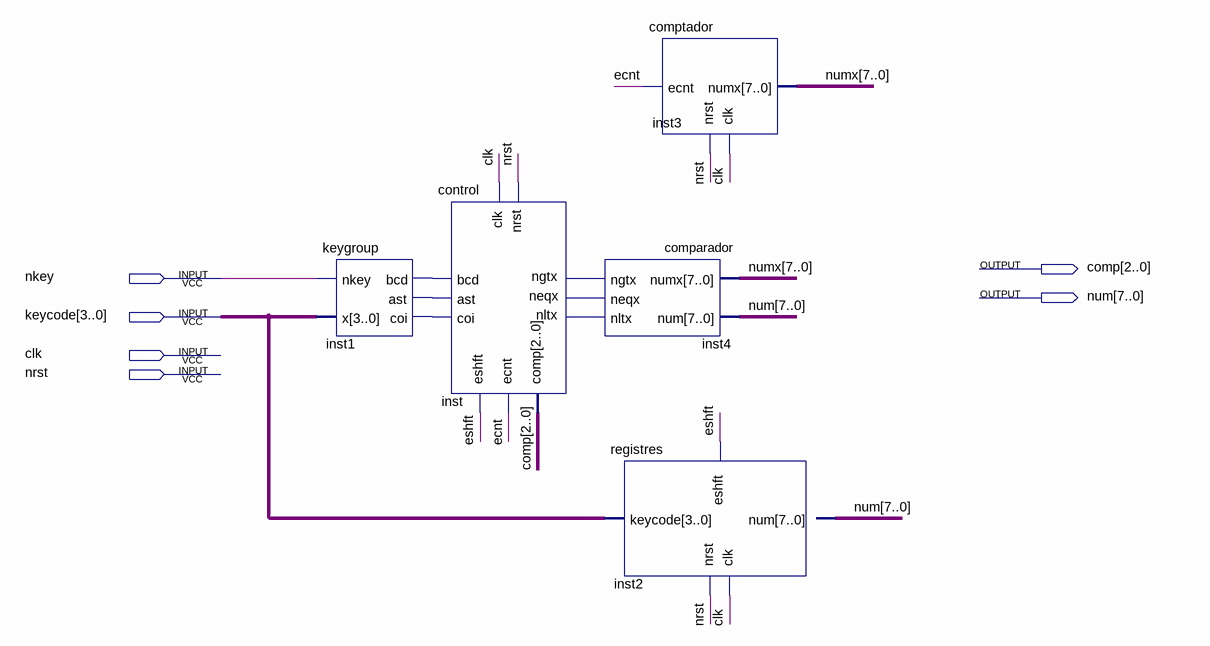
[diagram p0: schematic sheet]
// Quartus schematic joc.bdf as structural Verilog: 5 symbols, 6 pins
module joc (
  input  nkey,
  input  [3:0] keycode,
  input  clk,
  input  nrst,
  output [2:0] comp,
  output [7:0] num
);

  wire ecnt, eshft, inst1_ast, inst1_bcd, inst1_coi, inst4_neqx, inst4_ngtx, inst4_nltx;
  wire [7:0] numx;

  keygroup inst1 (.x(keycode), .nkey(nkey), .bcd(inst1_bcd), .ast(inst1_ast), .coi(inst1_coi));
  control inst (
    .bcd(inst1_bcd), .ast(inst1_ast), .coi(inst1_coi), .ngtx(inst4_ngtx), .neqx(inst4_neqx),
    .nltx(inst4_nltx), .clk(clk), .nrst(nrst), .eshft(eshft), .ecnt(ecnt), .comp(comp));
  comparador inst4 (.numx(numx), .num(num), .ngtx(inst4_ngtx), .neqx(inst4_neqx), .nltx(inst4_nltx));
  comptador inst3 (.ecnt(ecnt), .nrst(nrst), .clk(clk), .numx(numx));
  registres inst2 (.keycode(keycode), .clk(clk), .nrst(nrst), .eshft(eshft), .num(num));
endmodule
